# Altium schematic sheet [4]Button.SchDoc
size B
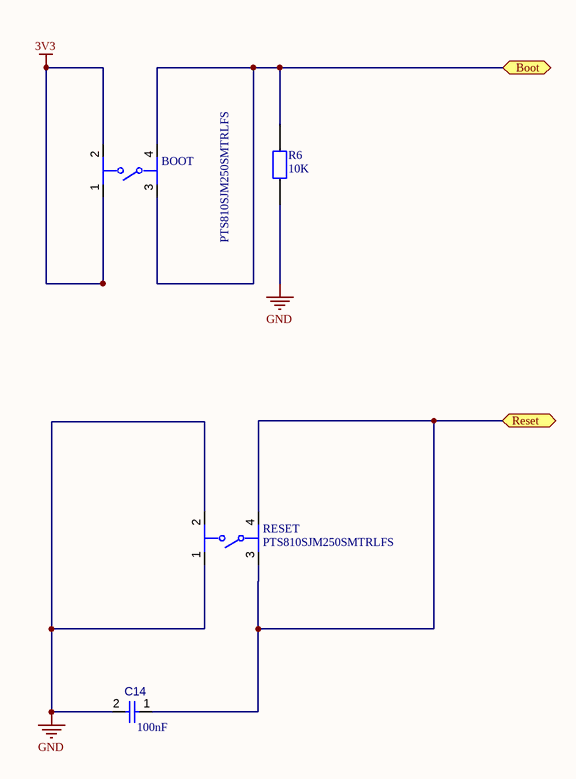
[diagram p0: [4]Button.SchDoc]

## Parts
BOOT  PTS810SJM250SMTRLFS  [FP-PTS810SJM250SMTRLFS-MFG]
C14  value 100nF  [CAPC1608X90X40ML10T20]  (hidden comment: Capacitor 100 nF +/-10% 50 V 0603)
R6  10K  [RESC0603]
RESET  PTS810SJM250SMTRLFS  [FP-PTS810SJM250SMTRLFS-MFG]

## Ports
Boot (bidir), Reset (bidir)

## Nets
3V3: BOOT.1 BOOT.2
GND: C14.2 R6.1 RESET.1 RESET.2
Boot: BOOT.3 BOOT.4 R6.2 ; port Boot
Reset: C14.1 RESET.3 RESET.4 ; port Reset

## Notes on the sheet
- 8
- 7
- 6
- 5
- 4
- 3
- DWG. NO.
- REV.
- SHT.
- REVISION
- 2
- DESCRIPTION
- DATE
- 1
- APPROVED
- THIS DOCUMENT AND THE DATA DISCLOSED HEREIN OR HEREWITH IS THE PROPERTY OF ALTIUM LIMITED AND MAY BE FREELY DISTRIBUTED IN WHOLE. NO RIGHTS ARE RESERVED OR EXPRESS OR IMPLIED WARANTEE GIVEN.
- F
- E
- D
- C
- B
- A
- SCALE:
- A3
- SIZE
- CAGE CODE
- FILE NAME
- DWG NO.
- SHEET
- OF
- REV

## Library data of the parts
BOOT RESET = Button: SWITCH TACTILE SPST-NO 0.05A 16V; Manufacturer: C&K Components; Throw Configuration: SPST; Contact Resistance: 500mΩ; Electromechanical Life: 150000Cycles; Operating Force: 160gf; Contact Current Rating: 50mA; Temperature: -40°C to +85°C; Device Class L2: Switches; Digikey Description: SWITCH TACTILE SPST-NO 0.05A 16V; Automotive: No; Height: 2.7mm; ComponentLink2Description: Datasheet; Temperature Range Low: -40°C; Device Class L1: Electromechanical; Mouser Description: Switch Tactile N.O. SPST Button J-Bend 0.05A 16VDC 150000Cycles 1.57N SMD T/R; Octopart: https://octopart.com/pts810+sjm+250+smtr+lfs-c%26k+components-29687929; Lead Free: Yes; Voltage Rating Dc: 16V; Temperature Range High: +85°C; Package: PTS810SJM250SMTRLFS; Manufacturer Part Number: PTS810SJM250SMTRLFS; ComponentLink2URL: https://www.ckswitches.com/media/1476/pts810.pdf; Category: Switch; RoHS: TRUE; Device Class L3: Tactile Switches
C14 = CMP-001-00017-4: Chip Capacitor, 100 nF, +/- 10%, 50 V, 0603 (1608 Metric); Capacitor Type: Ceramic; Voltage Rating: 50V; RoHS Compliant: True; Max Operating Temperature: 125°C; Pins: 2; Mounting Technology: SM; Min Operating Temperature: -55°C; Tolerance: 10%; Case/Package: 0603
R6 = ERJ-PA3F1002V: RES SMD 10K OHM 1% 1/4W 0603; Manufacturer: Panasonic Electronic Components; Power (Watts): 0.25W, 1/4W; Temperature Coefficient: ±100ppm/°C; Supplier 1: Digi-Key; Manufacturer Part Number: ERJ-PA3F1002V; RoHS: RoHS Compliant; Category: Resistors; Stock 1: 80783; Pricing 1: 1=0.23, 10=0.205, 25=0.142, 50=0.1102, 100=0.0789, 250=0.06144, 500=0.04884, 1000=0.03467 (CAD); Packaging: Digi-Reel®; Part Status: Active; Resistance (Ohms): 10k; Tolerance: ±1%; Composition: Thick Film; Features: Automotive AEC-Q200, Pulse Withstanding; Operating Temperature: -55°C ~ 155°C; Package / Case: 0603 (1608 Metric); Supplier Device Package: 0603; Size / Dimension: 0.063" L x 0.031" W (1.60mm x 0.80mm); Height - Seated (Max): 0.022" (0.55mm); Failure Rate: -; ComponentLink1URL: https://industrial.panasonic.com/cdbs/www-data/pdf/RDO0000/AOA0000C291.pdf; ComponentLink1Description: https://industrial.panasonic.com/cdbs/www-data/pdf/RDO0000/AOA0000C291.pdf; Supplier Part Number 1: P10KBYDKR-ND